# Altium project ADCS C2Sv0.1 - Shield.PrjPcb
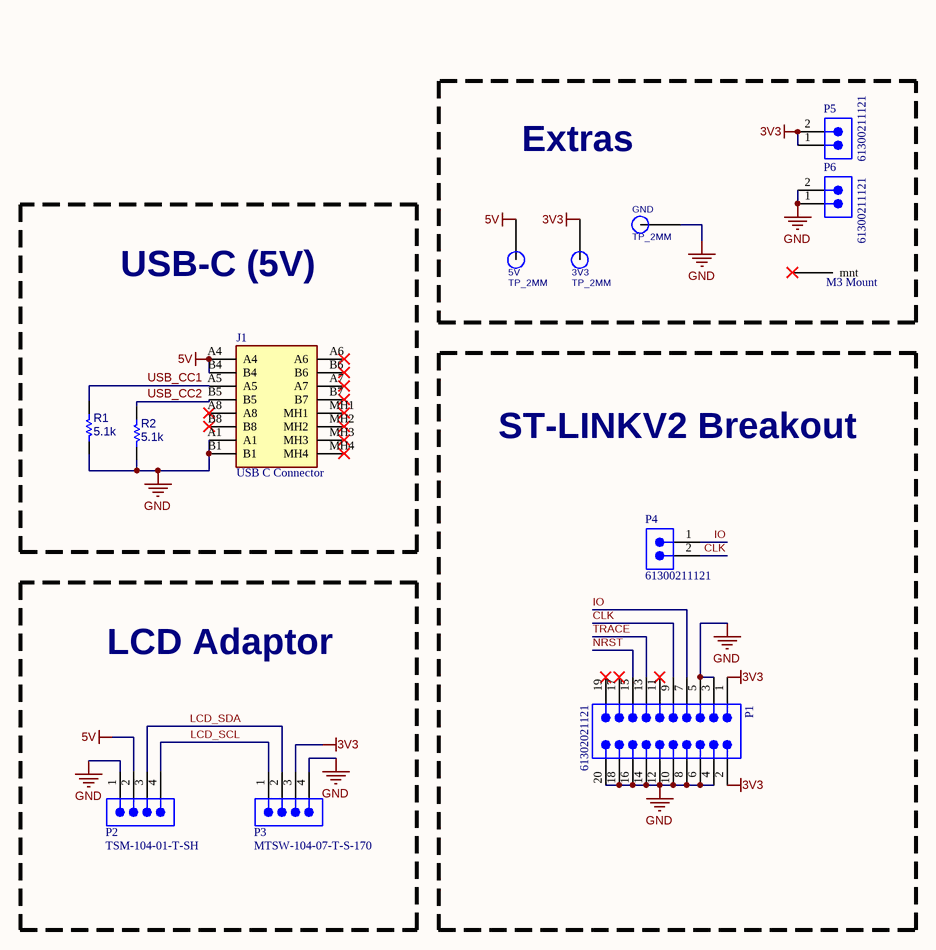
[diagram p0: ADCS C2Sv0.1 - Shield_TopLevel.SchDoc]
1 sheet, 13 parts. Net scope: global (net labels, ports and power ports of the same name join across sheets).
Board file: ADCS C2Sv0.1 - Shield.PcbDoc

## Sheet ADCS C2Sv0.1 - Shield_TopLevel.SchDoc
size A3; SheetNumber: 1; SheetTotal: 1

### Parts
3V3  TP_2MM  [TESTPOINT 2MM]
5V  TP_2MM  [TESTPOINT 2MM]
GND  TP_2MM  [TESTPOINT 2MM]
J1  USB C Connector  [UJ20CHGMSMT2P16TR]
MNT1  M3 Mount  [M3_Mount-Footprint-1]
P1  61302021121  [61302021121]
P2  TSM-104-01-T-SH  [SMTC-TSM-104-01-X-SH]
P3  MTSW-104-07-T-S-170  [SMTC-MTSW-104-07-X-S-170]
P4  61300211121  [61300211121]
P5  61300211121  [61300211121]
P6  61300211121  [61300211121]
R1  value 5.1k  [RESC1608X55X25ML10T15-1]  (hidden comment: Resistor 10k +/-1% 0603 100mW)
R2  value 5.1k  [RESC1608X55X25ML10T15-1]  (hidden comment: Resistor 10k +/-1% 0603 100mW)

### Blocks framed on the sheet
Extras: 3V3 5V GND MNT1 P5 P6
USB-C (5V): J1 R1 R2
ST-LINKV2 Breakout: P1 P4
LCD Adaptor: P2 P3

### Nets
3V3: 3V3.TP(TP_2MM) P1.1 P1.2 P3.3 P5.1 P5.2
5V: 5V.TP(TP_2MM) J1.A4 J1.B4 P2.2
GND: GND.TP(TP_2MM) J1.A1 J1.B1 P1.3 P1.4 P1.5 P1.6 P1.8 P1.10 P1.12 P1.14 P1.16 P1.18 P1.20 P2.1 P3.4 P6.1 P6.2 R1.2 R2.2
CLK: P1.9 P4.2
IO: P1.7 P4.1
LCD_SCL: P2.4 P3.1
LCD_SDA: P2.3 P3.2
NRST: P1.15
TRACE: P1.13
USB_CC1: J1.A5 R1.1
USB_CC2: J1.B5 R2.1

Not connected (* = marked no-connect by the designer): J1 A6* A7* A8* B6* B7* B8* MH1* MH2* MH3* MH4*; MNT1 1(mnt)*; P1 11* 17* 19*

### Notes on the sheet
- Title:
- Version:
- Revision:
- Perth Aerospace Student Team
- Size:
- Date:
- A3
- Project:
- Sheet
- of
- Author:
- Approved By:
- Curtin University
- Kent Street, Bentley
- Western Australia, 6152
- File:

### Library data of the parts
J1 = CMP-026-000123-2: UJ20-C-H-G-MSMT-2-P16-TR Connector; Manufacturer_Name: Same Sky; Height: 3.36mm; Source: SamacSys.SchLib; Design Item ID: UJ20-C-H-G-MSMT-2-P16-TR; Datasheet Link: https://cz.mouser.com/ProductDetail/Same-Sky/UJ20-C-H-G-MSMT-2-P16-TR?qs=IKkN%2F947nfBldcIwp9d6BA%3D%3D; Mouser Part Number: 179-UJ20CHGMSMT2P16T; Manufacturer_Part_Number: UJ20-C-H-G-MSMT-2-P16-TR; Mouser Price/Stock: https://www.mouser.co.uk/ProductDetail/Same-Sky/UJ20-C-H-G-MSMT-2-P16-TR?qs=IKkN%2F947nfBldcIwp9d6BA%3D%3D; Author: Raphael Ho
MNT1 = CMP-002-00124-2: M3 mounting hole; Author: Raphael Ho
P1 = CMP-1502-01104-4: THT Vertical Pin Header WR-PHD, Pitch 2.54 mm, Dual Row, 20 pins; Connector Type: Male Pin; Current Rating: 3A; Number of Contacts: 20; Gender: Male; Contact Resistance: 20mΩ; Pitch: 2.54mm; Operating Supply Voltage: 250V; Color: Black; Contact Mating Length: 5.9944mm; Termination: Solder; Packaging: Bulk; Lead Pitch: 2.54mm; Height: 8.89mm; Orientation: Vertical; Min Operating Temperature: -40°C; Max Operating Temperature: 105°C; Number of Positions: 20; Mount: Through Hole; RoHS: Compliant; Number of Pins: 20; Voltage Rating: 250V; Number of Rows: 2; Contact Plating: Gold; Row Spacing: 2.54mm; Contact Material: Gold
P2 = CMP-1024-00223-1: 0.025" SQ Post Header, Surface Mount, Horizontal, -55 to 105 degC, 2.54 mm Pitch, 4-Pin, Male, RoHS; Manufacturer: Samtec; Pitch: 2.54 mm; ComponentLink1URL: http://www.samtec.com; ComponentLink3URL: http://www.samtec.com/documents/webfiles/cpdf/TSM-1XX-XX-XXX-SH-XX-XXX-XX-MKT1.pdf; Temperature Range: -55 to 105 degC; Orientation: Horizontal; ComponentLink1Description: Manufacturer URL; PackageReference: TSM-104-01-X-SH; PackageDescription: Terminal Strip Single Surface Mount; ComponentLink2Description: Datasheet; ComponentLink2URL: http://www.samtec.com/documents/webfiles/pdf/TSM.PDF; RoHS: True; ComponentLink3Description: Package Specification; Mounting Technology: Surface Mount; PackageVersion: CD, 7/1991; PartNumber: TSM-104-01-T-SH; DatasheetVersion: F-214
P3 = CMP-1024-00105-1: Modified .025" SQ Post Header, Through-hole, Vertical, -55 to 105 degC, 2.54 mm Pitch, 4-Pin, Male, RoHS; Manufacturer: Samtec; Pitch: 2.54 mm; PartNumber: MTSW-104-07-T-S-170; ComponentLink3Description: Package Specification; ComponentLink2URL: http://www.samtec.com/documents/webfiles/pdf/MTSW.PDF; Temperature Range: -55 to 105 degC; DatasheetVersion: F-214; ComponentLink3URL: http://www.samtec.com/documents/webfiles/cpdf/MTSW-XXX-XX-X-X-XXXX-XX-XXX-MKT1.pdf; Orientation: Vertical; ComponentLink1URL: http://www.samtec.com; RoHS: True; PackageReference: MTSW-104-07-X-S-170; ComponentLink1Description: Manufacturer URL; Mounting Technology: Through-hole; PackageDescription: Assembly .025" [.64] SQ Post Terminal Strip; PackageVersion: BI, 2/1987; ComponentLink2Description: Datasheet
P4-P6 = CMP-096-000133-1: WR-PHD Pin Header, THT, Vertical, pitch 2.54mm, 1 Row, 2P; Manufacturer: Wurth Elektronik; Working Voltage: 250V; Contact Resistance: 20mOhm; Rated Current: 3A; Withstanding Voltage: 500V; Orientation: Vertical; Number of Rows: 1; Match Code: WR-PHD; Pin Count: 2; Gender: Pin Header; Source: WR-PHD.SchLib; Packaging: Bag; Manufacturer Part Number: 61300211121; Operating Temperature Min: -40°C; Component Type: Standard; ComponentLink1URL: https://www.we-online.com/redexpert/article/61300211121?ad; Pitch: 2.54mm; Mount: Through Hole; ComponentLink1Description: Website Link; ComponentLink2Description: Datasheet Link; Number of Pins: 2; Category: Board-to-Board Connectors; Design Item ID: 61300211121; ComponentLink2URL: https://www.we-online.com/redexpert/spec/61300211121?ad; Operating Temperature Max: 105°C
R1 R2 = CMP-009-00181-1: Chip Resistor, 10k Ohm, 0.1 W, -55 to 155 degC, 0603 (1608 Metric); Voltage Rating: 50V; Tolerance: 1%; Source: Components - 14.11.22 - 11.28.SchLib; Design Item ID: CMP-009-00006-5; Created by: Micah Randall; Power: 100mW; Max Operating Temperature: 155°C; RoHS Compliant: Yes; Mounting Technology: SM; Case/Package: 0603; Min Operating Temperature: -55°C; Pins: 2